# EAGLE schematic Arduino Emoji (EAGLE 7.5.0)

## Sheet 1 of 2
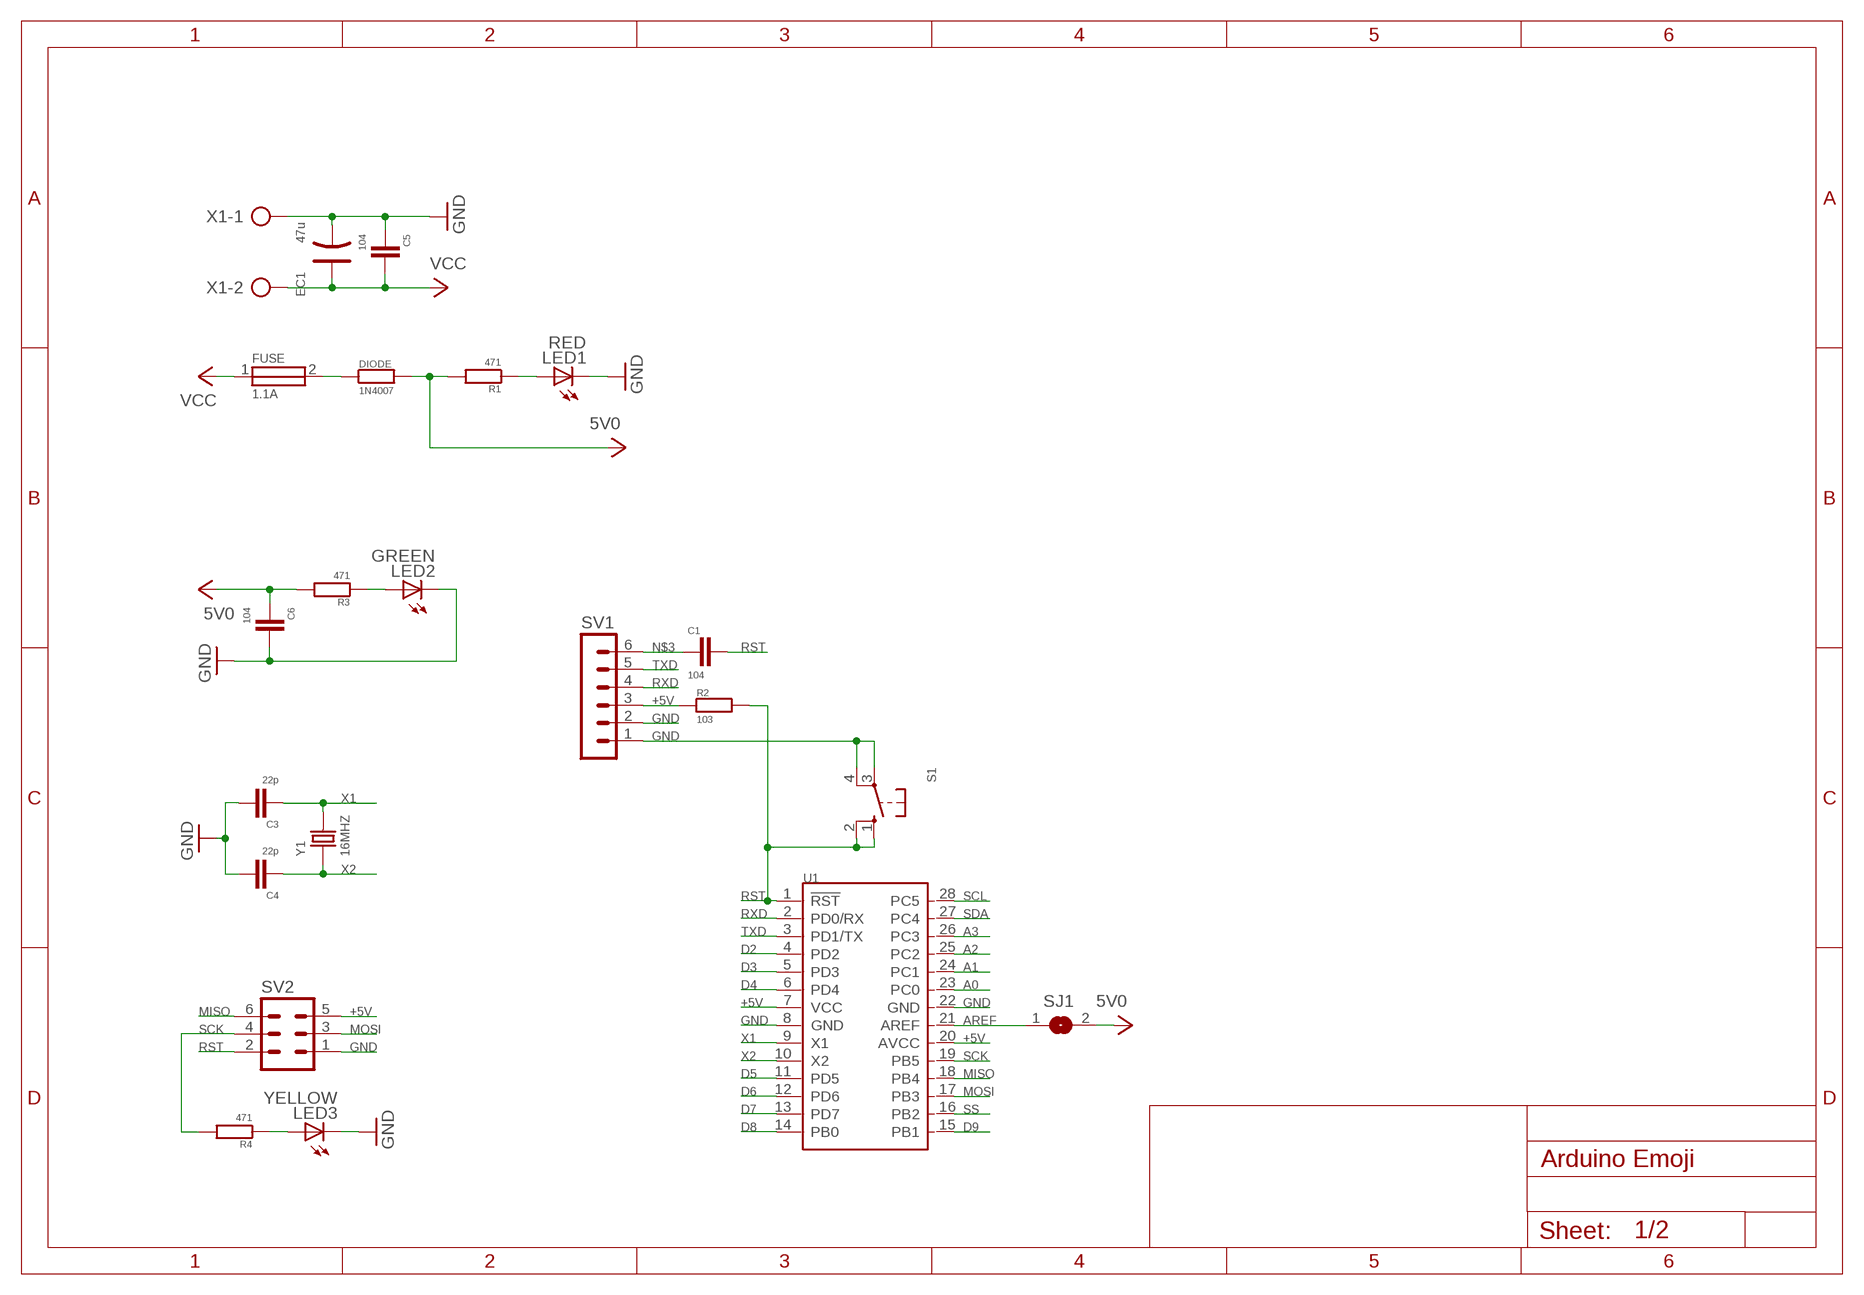
[diagram p0: schematic, sheet 1]

### Parts
C1  104  CDIP  [CDIP]
C3  22p  CDIP  [CDIP]
C4  22p  CDIP  [CDIP]
C5  104  CDIP  [CDIP]
C6  104  CDIP  [CDIP]
DIODE  1N4007  RDIP  [RDIP]
EC1  47u  ELECTRO-DIP  [ELECTRO-DIP]
FUSE  1.1A  FUSE0805  [F0805]
LED1  RED  LEDSQR2X5  [LED2X5]
LED2  GREEN  LEDSQR2X5  [LED2X5]
LED3  YELLOW  LEDSQR2X5  [LED2X5]
R1  471  RDIP  [RDIP]
R2  103  RDIP  [RDIP]
R3  471  RDIP  [RDIP]
R4  471  RDIP  [RDIP]
S1  TS-DIP-4.54.5  [TS-DIP-4.5*4.5]
SJ1  SJ  [SJ]
SV1  MA06-1  [MA06-1]
SV2  MA03-2  [MA03-2]
U1  MCU-ATMEGA328P-PU(DIP28)  [DIP28-2.54-35.6X13.5MM]
X1  AK500/2  [AK500/2]
Y1  16MHZ  DIP-CRYSTAL-16MHZ-18PF-30PPM-40R(HC49US)  [HC49US]

### Nets
+5V: C6.P$2 DIODE.P$2 R1.P$2 R2.P$1 R3.P$2 SJ1.2 SV1.3 SV2.5 U1.7(VCC) U1.20(AVCC) ; supply symbol labelled 5V0 ; also sheet 2
A0: U1.23(PC0)
A1: U1.24(PC1)
A2: U1.25(PC2)
A3: U1.26(PC3)
AREF: SJ1.1 U1.21(AREF)
D2: U1.4(PD2)
D3: U1.5(PD3)
D4: U1.6(PD4)
D5: U1.11(PD5)
D6: U1.12(PD6)
D7: U1.13(PD7)
D8: U1.14(PB0)
D9: U1.15(PB1)
GND: C3.P$1 C4.P$1 C5.P$2 C6.P$1 EC1.- LED1.K(C) LED2.K(C) LED3.K(C) S1.3(P) S1.4(P1) SV1.1 SV1.2 SV2.1 U1.8(GND) U1.22(GND) X1.1 ; also sheet 2
MISO: SV2.6 U1.18(PB4)
MOSI: SV2.3 U1.17(PB3)
N$1: LED3.A R4.P$1
N$2: DIODE.P$1 FUSE.2
N$3: C1.P$2 SV1.6
N$4: LED1.A R1.P$1
N$10: LED2.A R3.P$1
RST: C1.P$1 R2.P$2 S1.1(S) S1.2(S1) SV2.2 U1.1(!RST)
RXD: SV1.4 U1.2(PD0/RX)
SCK: R4.P$2 SV2.4 U1.19(PB5)
SCL: U1.28(PC5)
SDA: U1.27(PC4)
SS: U1.16(PB2)
TXD: SV1.5 U1.3(PD1/TX)
VCC: C5.P$1 EC1.+ FUSE.1 X1.2
X1: C3.P$2 U1.9(X1) Y1.2
X2: C4.P$2 U1.10(X2) Y1.1

## Sheet 2 of 2
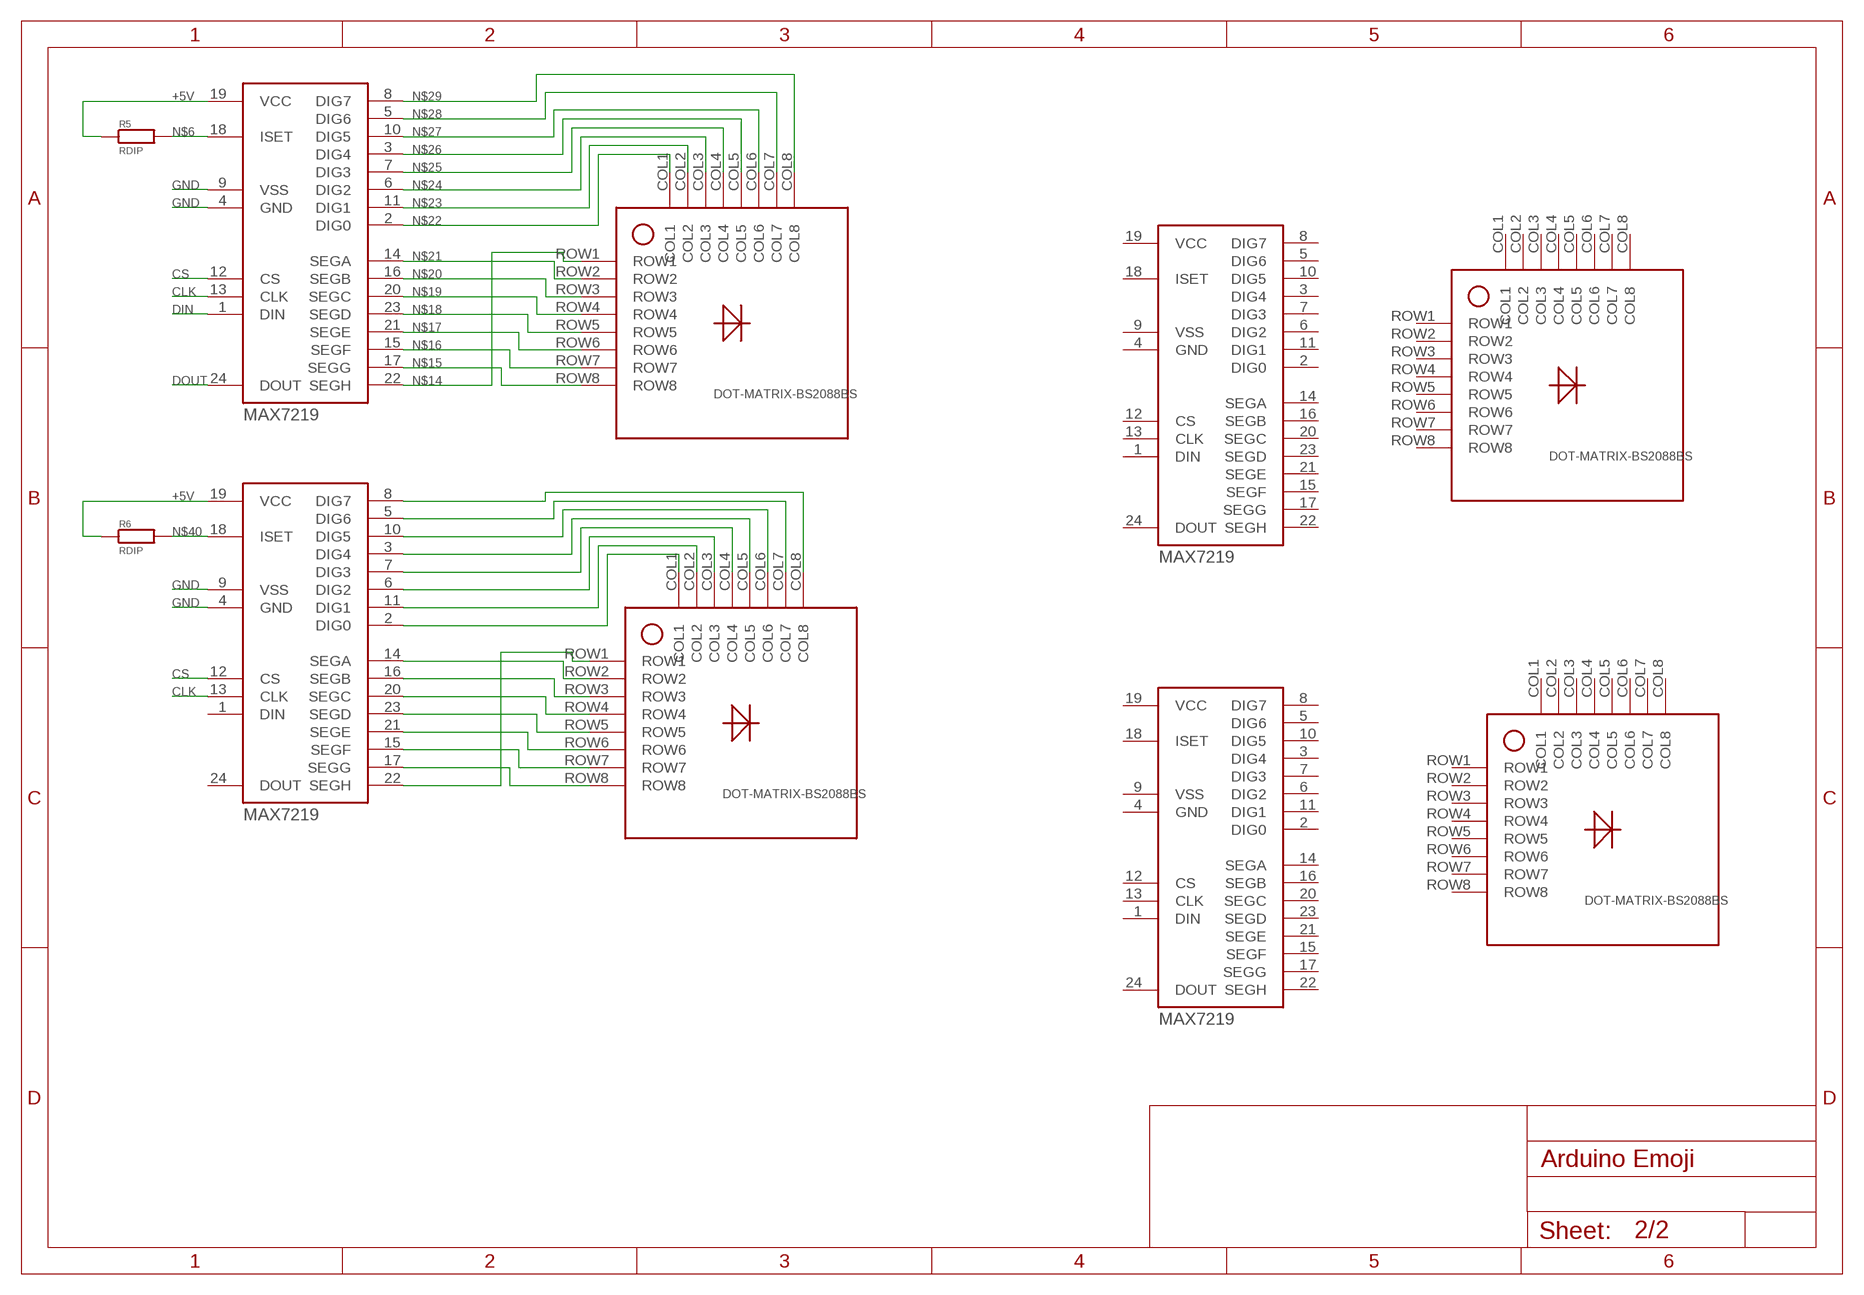
[diagram p1: schematic, sheet 2]

### Parts
R5  RDIP  [RDIP]
R6  RDIP  [RDIP]
U$1  MAX7219  [SOP24]
U$2  MAX7219  [SOP24]
U$3  MAX7219  [SOP24]
U$4  MAX7219  [SOP24]
U$5  DOT-MATRIX-BS2088BS  [2088BS]
U$6  DOT-MATRIX-BS2088BS  [2088BS]
U$7  DOT-MATRIX-BS2088BS  [2088BS]
U$8  DOT-MATRIX-BS2088BS  [2088BS]

### Nets
+5V: R5.P$1 R6.P$1 U$1.19(VCC) U$2.19(VCC) ; also sheet 1
CLK: U$1.13(CLK) U$2.13(CLK)
CS: U$1.12(CS) U$2.12(CS)
DIN: U$1.1(DIN)
DOUT: U$1.24(DOUT)
GND: U$1.4(GND) U$1.9(VSS) U$2.4(GND) U$2.9(VSS) ; also sheet 1
N$5: U$2.14(SEGA) U$6.ROW2
N$6: R5.P$2 U$1.18(ISET)
N$7: U$2.16(SEGB) U$6.ROW3
N$8: U$2.20(SEGC) U$6.ROW4
N$9: U$2.23(SEGD) U$6.ROW5
N$11: U$2.21(SEGE) U$6.ROW6
N$12: U$2.15(SEGF) U$6.ROW7
N$13: U$2.17(SEGG) U$6.ROW8
N$14: U$1.22(SEGH) U$5.ROW1
N$15: U$1.17(SEGG) U$5.ROW8
N$16: U$1.15(SEGF) U$5.ROW7
N$17: U$1.21(SEGE) U$5.ROW6
N$18: U$1.23(SEGD) U$5.ROW5
N$19: U$1.20(SEGC) U$5.ROW4
N$20: U$1.16(SEGB) U$5.ROW3
N$21: U$1.14(SEGA) U$5.ROW2
N$22: U$1.2(DIG0) U$5.COL1
N$23: U$1.11(DIG1) U$5.COL2
N$24: U$1.6(DIG2) U$5.COL3
N$25: U$1.7(DIG3) U$5.COL4
N$26: U$1.3(DIG4) U$5.COL5
N$27: U$1.10(DIG5) U$5.COL6
N$28: U$1.5(DIG6) U$5.COL7
N$29: U$1.8(DIG7) U$5.COL8
N$30: U$2.22(SEGH) U$6.ROW1
N$31: U$2.2(DIG0) U$6.COL1
N$32: U$2.11(DIG1) U$6.COL2
N$33: U$2.6(DIG2) U$6.COL3
N$34: U$2.7(DIG3) U$6.COL4
N$35: U$2.3(DIG4) U$6.COL5
N$36: U$2.10(DIG5) U$6.COL6
N$37: U$2.5(DIG6) U$6.COL7
N$38: U$2.8(DIG7) U$6.COL8
N$40: R6.P$2 U$2.18(ISET)
Unconnected: U$2.1(DIN) U$2.24(DOUT) U$3.1(DIN) U$3.2(DIG0) U$3.3(DIG4) U$3.5(DIG6) U$3.6(DIG2) U$3.7(DIG3) U$3.8(DIG7) U$3.10(DIG5) U$3.11(DIG1) U$3.12(CS) U$3.13(CLK) U$3.14(SEGA) U$3.15(SEGF) U$3.16(SEGB) U$3.17(SEGG) U$3.18(ISET) U$3.20(SEGC) U$3.21(SEGE) U$3.22(SEGH) U$3.23(SEGD) U$3.24(DOUT) U$4.1(DIN) U$4.2(DIG0) U$4.3(DIG4) U$4.5(DIG6) U$4.6(DIG2) U$4.7(DIG3) U$4.8(DIG7) U$4.10(DIG5) U$4.11(DIG1) U$4.12(CS) U$4.13(CLK) U$4.14(SEGA) U$4.15(SEGF) U$4.16(SEGB) U$4.17(SEGG) U$4.18(ISET) U$4.20(SEGC) U$4.21(SEGE) U$4.22(SEGH) U$4.23(SEGD) U$4.24(DOUT) U$7.COL1 U$7.COL2 U$7.COL3 U$7.COL4 U$7.COL5 U$7.COL6 U$7.COL7 U$7.COL8 U$7.ROW1 U$7.ROW2 U$7.ROW3 U$7.ROW4 U$7.ROW5 U$7.ROW6 U$7.ROW7 U$7.ROW8 U$8.COL1 U$8.COL2 U$8.COL3 U$8.COL4 U$8.COL5 U$8.COL6 U$8.COL7 U$8.COL8 U$8.ROW1 U$8.ROW2 U$8.ROW3 U$8.ROW4 U$8.ROW5 U$8.ROW6 U$8.ROW7 U$8.ROW8

## Power pins joined to a net without a drawn wire
GND: U$3.4(GND) U$4.4(GND)
VCC: U$3.19(VCC) U$4.19(VCC)
VSS: U$3.9(VSS) U$4.9(VSS)

## Library data of the parts
C1 C3-C6 = RCLDA:C: CAPACITOR
DIODE R1-R6 = RCLDA:R: RESISTOR
EC1 = RCLDA:ELECTRO-DIP
FUSE = RCLDA:FUSE
LED1-LED3 = Display:LED: LED OSRAM: - CHIPLED LG R971, LG N971, LY N971, LG Q971, LY Q971, LO R971, LY R971 LH N974, LH R974 LS Q976, LO Q976, LY Q976 LO Q996 - Hyper CHIPLED LW Q18S LB Q993, LB Q99A, LB R99A - SideLED LS A670, LO A670, LY A670, LG A670, LP A670 LB A673, LV A673, LT A673, LW A673 LH A674 LY A675 LS A676, LA A676, LO A676, LY A676, LW A676 LS A679, LY A679, LG A679 - Hyper Micro SIDELED® LS Y876, LA Y876, LO Y876, LY Y876 LT Y87S - SmartLED LW L88C, LW L88S LB L89C, LB L89S, LG L890 LS L89K, LO L89K, LY L89K LS L896, LA L896, LO L896, LY L896 - TOPLED LS T670, LO T670, LY T670, LG T670, LP T670 LSG T670, LSP T670, LSY T670, LOP T670, LYG T670 LG T671, LOG T671, LSG T671 LB T673, LV T673, LT T673, LW T673 LH T674 LS T676, LA T676, LO T676, LY T676, LB T676, LH T676, LSB T676, LW T676 LB T67C, LV T67C, LT T67C, LS T67K, LO T67K, LY T67K, LW E67C LS E67B, LA E67B, LO E67B, LY E67B, LB E67C, LV E67C, LT E67C LW T67C LS T679, LY T679, LG T679 LS T770, LO T770, LY T770, LG T770, LP T770 LB T773, LV T773, LT T773, LW T773 LH T774 LS E675, LA E675, LY E675, LS T675 LS T776, LA T776, LO T776, LY T776, LB T776 LHGB T686 LT T68C, LB T68C - Hyper Mini TOPLED® LB M676 - Mini TOPLED Santana® LG M470 LS M47K, LO M47K, LY M47K Source: http://www.osram.convergy.de LUXEON: - LUMILED® LXK2-PW12-R00, LXK2-PW12-S00, LXK2-PW14-U00, LXK2-PW14-V00 LXK2-PM12-R00, LXK2-PM12-S00, LXK2-PM14-U00 LXK2-PE12-Q00, LXK2-PE12-R00, LXK2-PE12-S00, LXK2-PE14-T00, LXK2-PE14-U00 LXK2-PB12-K00, LXK2-PB12-L00, LXK2-PB12-M00, LXK2-PB14-N00, LXK2-PB14-P00, LXK2-PB14-Q00 LXK2-PR12-L00, LXK2-PR12-M00, LXK2-PR14-Q00, LXK2-PR14-R00 LXK2-PD12-Q00, LXK2-PD12-R00, LXK2-PD12-S00 LXK2-PH12-R00, LXK2-PH12-S00 LXK2-PL12-P00, LXK2-PL12-Q00, LXK2-PL12-R00 Source: www.luxeon.com KINGBRIGHT: KA-3528ASYC Source: www.kingbright.com
S1 = Button:TS-DIP-4.5*4.5: OMRON SWITCH; MPN: B3F-1000; OC_FARNELL: 176432; OC_NEWARK: 36M3542
SJ1 = Jumper:SJ: SMD solder JUMPER
SV1 = Pin-Header:MA06-1: PIN HEADER; OC_FARNELL: unknown; OC_NEWARK: unknown
SV2 = Pin-Header:MA03-2: PIN HEADER; OC_FARNELL: unknown; OC_NEWARK: unknown
U1 = Chip:MCU-ATMEGA328P-PU(DIP28): 310010051; MPN: ATMEGA328P-PU; VALUE-DIP28: ATMEGA328P-PU
U$1-U$4 = Chip:MAX7219
U$5-U$8 = Display:DOT-MATRIX-BS
X1 = Connector:AK500/2: CONNECTOR; OC_FARNELL: unknown; OC_NEWARK: unknown
Y1 = Crystal:DIP-CRYSTAL-16MHZ-18PF-30PPM-40R(HC49US): 306010014; MPN: HC-49US 16.000MHz